# EAGLE design Final (EAGLE 9.4.2)

## Sheet 1 of 2
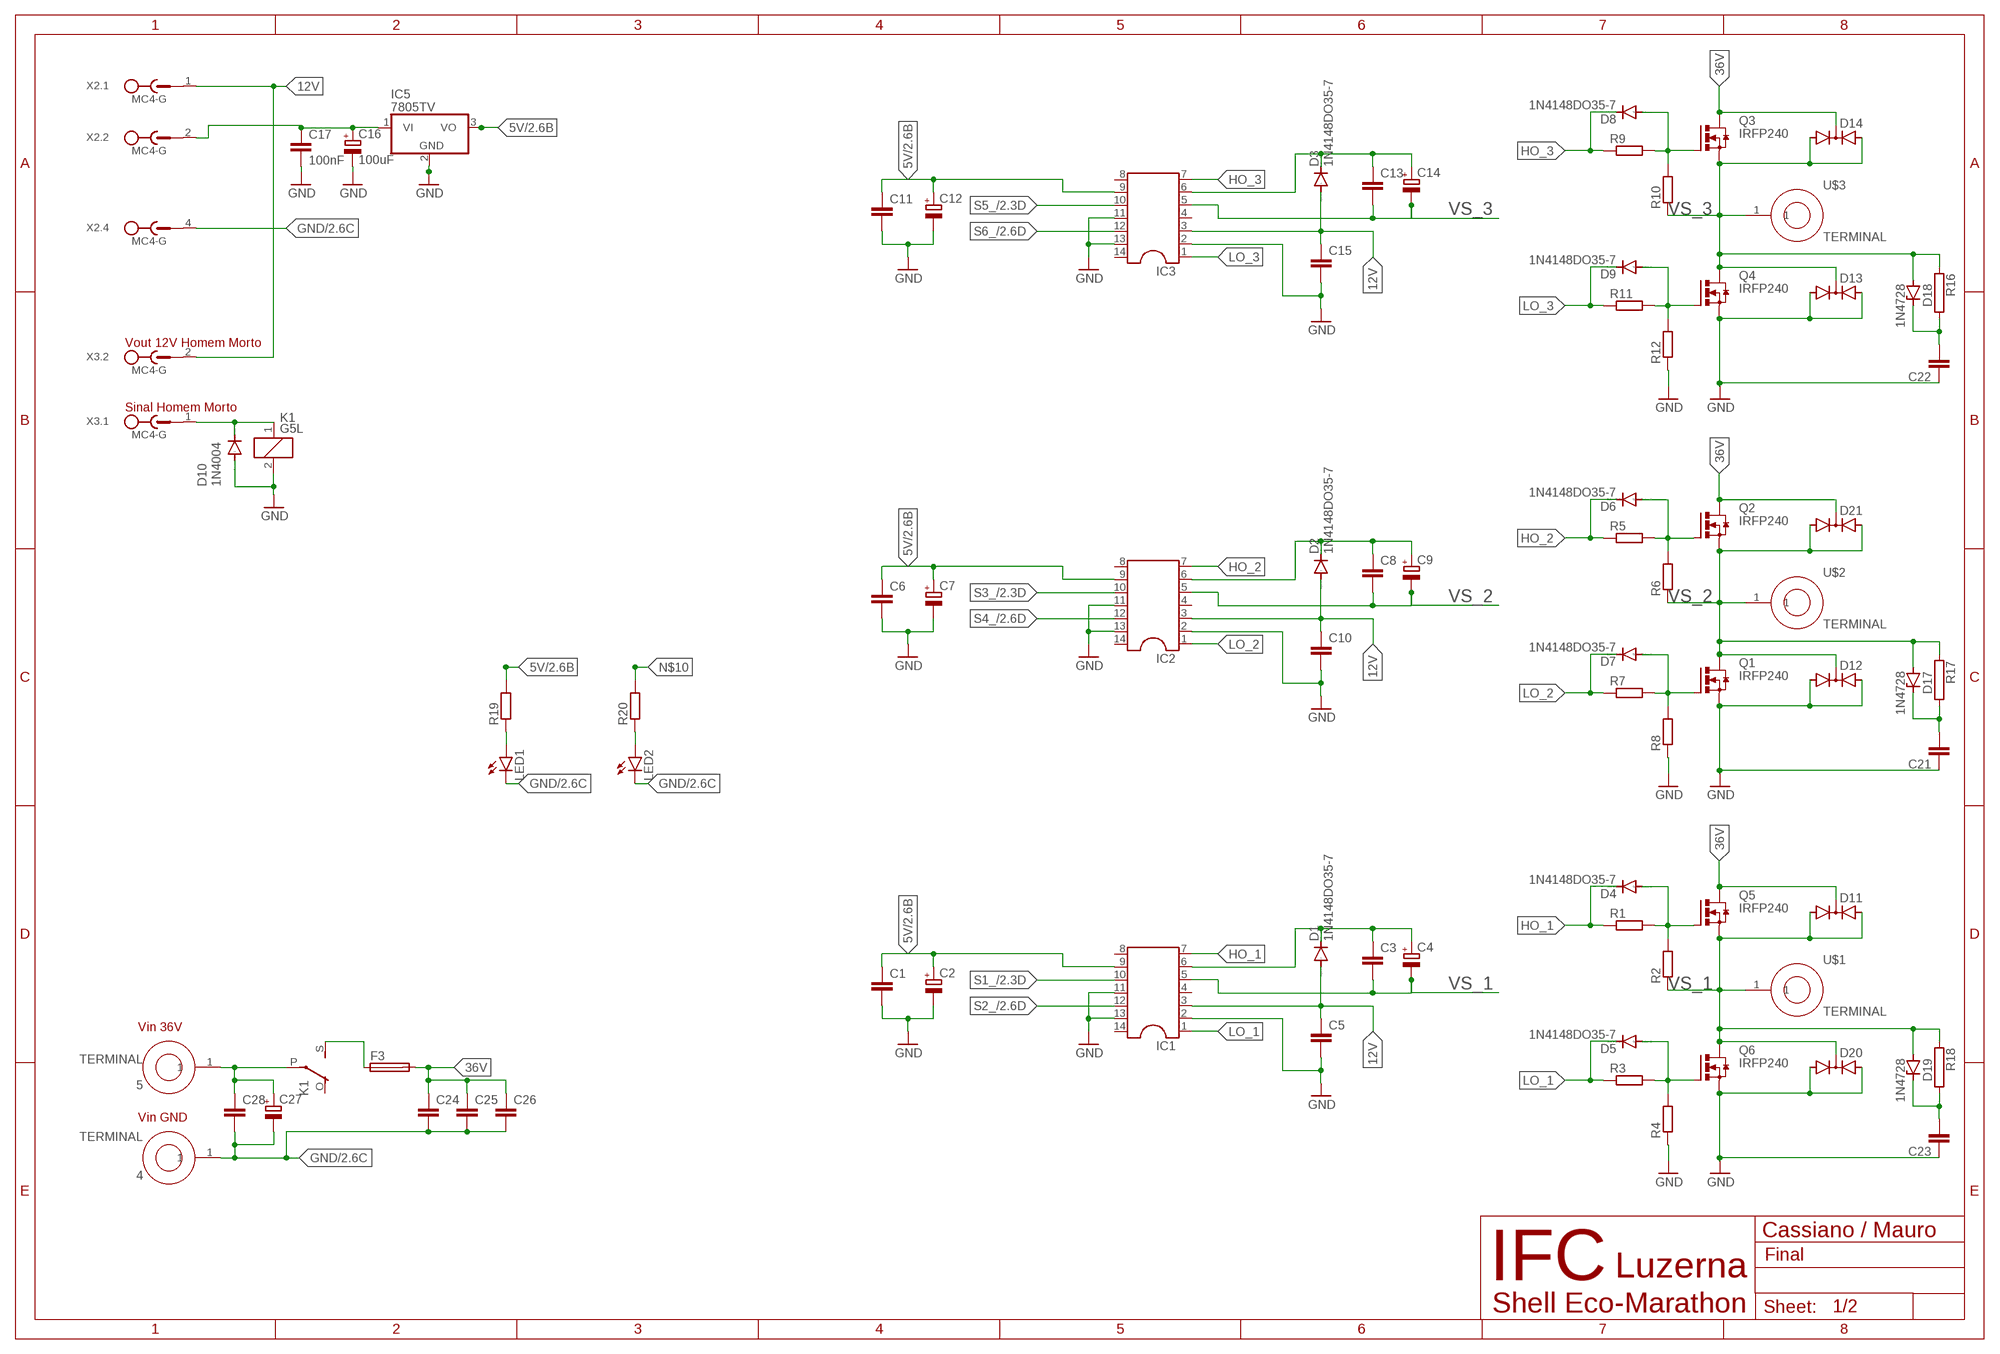
[diagram p0: schematic, sheet 1]

### Parts
4  TERMINAL  [TERMINAL]
5  TERMINAL  [TERMINAL]
C1  C-EU050-045X075  [C050-045X075]
C2  CPOL-EUE2.5-7  [E2,5-7]
C3  C-EU050-025X075  [C050-025X075]
C4  CPOL-EUE2.5-7  [E2,5-7]
C5  C-EU050-025X075  [C050-025X075]
C6  C-EU050-045X075  [C050-045X075]
C7  CPOL-EUE2.5-7  [E2,5-7]
C8  C-EU050-025X075  [C050-025X075]
C9  CPOL-EUE2.5-7  [E2,5-7]
C10  C-EU050-025X075  [C050-025X075]
C11  C-EU050-045X075  [C050-045X075]
C12  CPOL-EUE2.5-7  [E2,5-7]
C13  C-EU050-025X075  [C050-025X075]
C14  CPOL-EUE2.5-7  [E2,5-7]
C15  C-EU050-025X075  [C050-025X075]
C16  100uF  CPOL-EUE2.5-7  [E2,5-7]
C17  100nF  C-EU050-045X075  [C050-045X075]
C21  C-EU150-054X183  [C150-054X183]
C22  C-EU150-054X183  [C150-054X183]
C23  C-EU150-054X183  [C150-054X183]
C24  C-EU275-093X316  [C275-093X316]
C25  C-EU275-093X316  [C275-093X316]
C26  C-EU275-093X316  [C275-093X316]
C27  CPOL-EUE10-22.5  [EB22,5D]
C28  C-EU275-093X316  [C275-093X316]
D1  1N4148DO35-7  [DO35-7]
D2  1N4148DO35-7  [DO35-7]
D3  1N4148DO35-7  [DO35-7]
D4  1N4148DO35-7  [DO35-7]
D5  1N4148DO35-7  [DO35-7]
D6  1N4148DO35-7  [DO35-7]
D7  1N4148DO35-7  [DO35-7]
D8  1N4148DO35-7  [DO35-7]
D9  1N4148DO35-7  [DO35-7]
D10  1N4004  [DO41-10]
D11  DIODE-2AC|CATO220V  [TO220ABS]
D12  DIODE-2AC|CATO220V  [TO220ABS]
D13  DIODE-2AC|CATO220V  [TO220ABS]
D14  DIODE-2AC|CATO220V  [TO220ABS]
D17  1N4728  [DO41Z10]
D18  1N4728  [DO41Z10]
D19  1N4728  [DO41Z10]
D20  DIODE-2AC|CATO220V  [TO220ABS]
D21  DIODE-2AC|CATO220V  [TO220ABS]
F3  SH22,5A  [SH22,5A]
IC1  DIL14  [DIL14]
IC2  DIL14  [DIL14]
IC3  DIL14  [DIL14]
IC5  7805TV  [TO220V]
K1  G5L  [G5LE]
LED1  LED5MM  [LED5MM]
LED2  LED5MM  [LED5MM]
Q1  IRFP240  [TO247BV]
Q2  IRFP240  [TO247BV]
Q3  IRFP240  [TO247BV]
Q4  IRFP240  [TO247BV]
Q5  IRFP240  [TO247BV]
Q6  IRFP240  [TO247BV]
R1  R-EU_0204/7  [0204/7]
R2  R-EU_0204/7  [0204/7]
R3  R-EU_0204/7  [0204/7]
R4  R-EU_0204/7  [0204/7]
R5  R-EU_0204/7  [0204/7]
R6  R-EU_0204/7  [0204/7]
R7  R-EU_0204/7  [0204/7]
R8  R-EU_0204/7  [0204/7]
R9  R-EU_0204/7  [0204/7]
R10  R-EU_0204/7  [0204/7]
R11  R-EU_0204/7  [0204/7]
R12  R-EU_0204/7  [0204/7]
R16  RCA4150  [CA4150]
R17  RCA4150  [CA4150]
R18  RCA4150  [CA4150]
R19  R-EU_0204/7  [0204/7]
R20  R-EU_0204/7  [0204/7]
U$1  TERMINAL  [TERMINAL]
U$2  TERMINAL  [TERMINAL]
U$3  TERMINAL  [TERMINAL]
X2  MC4-G  [MC4-G]
X3  MC4-G  [MC4-G]

### Nets
5V: C1.1 C2.+ C6.1 C7.+ C11.1 C12.+ IC1.9 IC2.9 IC3.9 IC5.3(VO) R19.2 ; also sheet 2
12V: C5.1 C10.1 C15.1 D1.A D2.A D3.A IC1.3 IC2.3 IC3.3 X2.1 X3.2
36V: C24.1 C25.1 C26.1 D11.C D14.C D21.C F3.2 Q2.D Q3.D Q5.D
GND: 4.1 C1.2 C2.- C5.2 C6.2 C7.- C10.2 C11.2 C12.- C15.2 C16.- C17.2 C21.1 C22.1 C23.1 C24.2 C25.2 C26.2 C27.- C28.2 D10.A D12.A1 D12.A2 D13.A1 D13.A2 D20.A1 D20.A2 IC1.2 IC1.11 IC1.13 IC2.2 IC2.11 IC2.13 IC3.2 IC3.11 IC3.13 IC5.2(GND) K1.2 LED1.K(C) LED2.K(C) Q1.S Q4.S Q6.S R4.1 R8.1 R12.1 X2.4 ; also sheet 2
HO_1: D4.C IC1.7 R1.1
HO_2: D6.C IC2.7 R5.1
HO_3: D8.C IC3.7 R9.1
LO_1: D5.C IC1.1 R3.1
LO_2: D7.C IC2.1 R7.1
LO_3: D9.C IC3.1 R11.1
N$1: D4.A Q5.G R1.2 R2.2
N$2: D5.A Q6.G R3.2 R4.2
N$3: F3.1 K1.S(2:S)
N$4: D6.A Q2.G R5.2 R6.2
N$5: D7.A Q1.G R7.2 R8.2
N$7: D8.A Q3.G R9.2 R10.2
N$8: D9.A Q4.G R11.2 R12.2
N$9: C16.+ C17.1 IC5.1(VI) X2.2
N$10: D10.C K1.1 R20.2 X3.1
N$11: 5.1 C27.+ C28.1 K1.P(2:P)
N$14: LED1.A R19.1
N$19: LED2.A R20.1
N$29: C22.2 D18.C R16.2
N$30: C21.2 D17.C R17.2
N$31: C23.2 D19.C R18.2
S1_: IC1.10 ; also sheet 2
S2_: IC1.12 ; also sheet 2
S3_: IC2.10 ; also sheet 2
S4_: IC2.12 ; also sheet 2
S5_: IC3.10 ; also sheet 2
S6_: IC3.12 ; also sheet 2
VB_1: C3.1 C4.+ D1.C IC1.6
VB_2: C8.1 C9.+ D2.C IC2.6
VB_3: C13.1 C14.+ D3.C IC3.6
VS_1: C3.2 C4.- D11.A1 D11.A2 D19.A D20.C IC1.5 Q5.S Q6.D R2.1 R18.1 U$1.1
VS_2: C8.2 C9.- D12.C D17.A D21.A1 D21.A2 IC2.5 Q1.D Q2.S R6.1 R17.1 U$2.1
VS_3: C13.2 C14.- D13.C D14.A1 D14.A2 D18.A IC3.5 Q3.S Q4.D R10.1 R16.1 U$3.1
Unconnected: IC1.4 IC1.8 IC1.14 IC2.4 IC2.8 IC2.14 IC3.4 IC3.8 IC3.14 K1.O(2:O) X2.3 X3.3 X3.4

### Notes on the sheet
- Vout 12V Homem Morto
- Sinal Homem Morto
- Vin 36V
- Vin GND
- Cassiano / Mauro
- IFC | Luzerna
- Shell Eco-Marathon

## Sheet 2 of 2
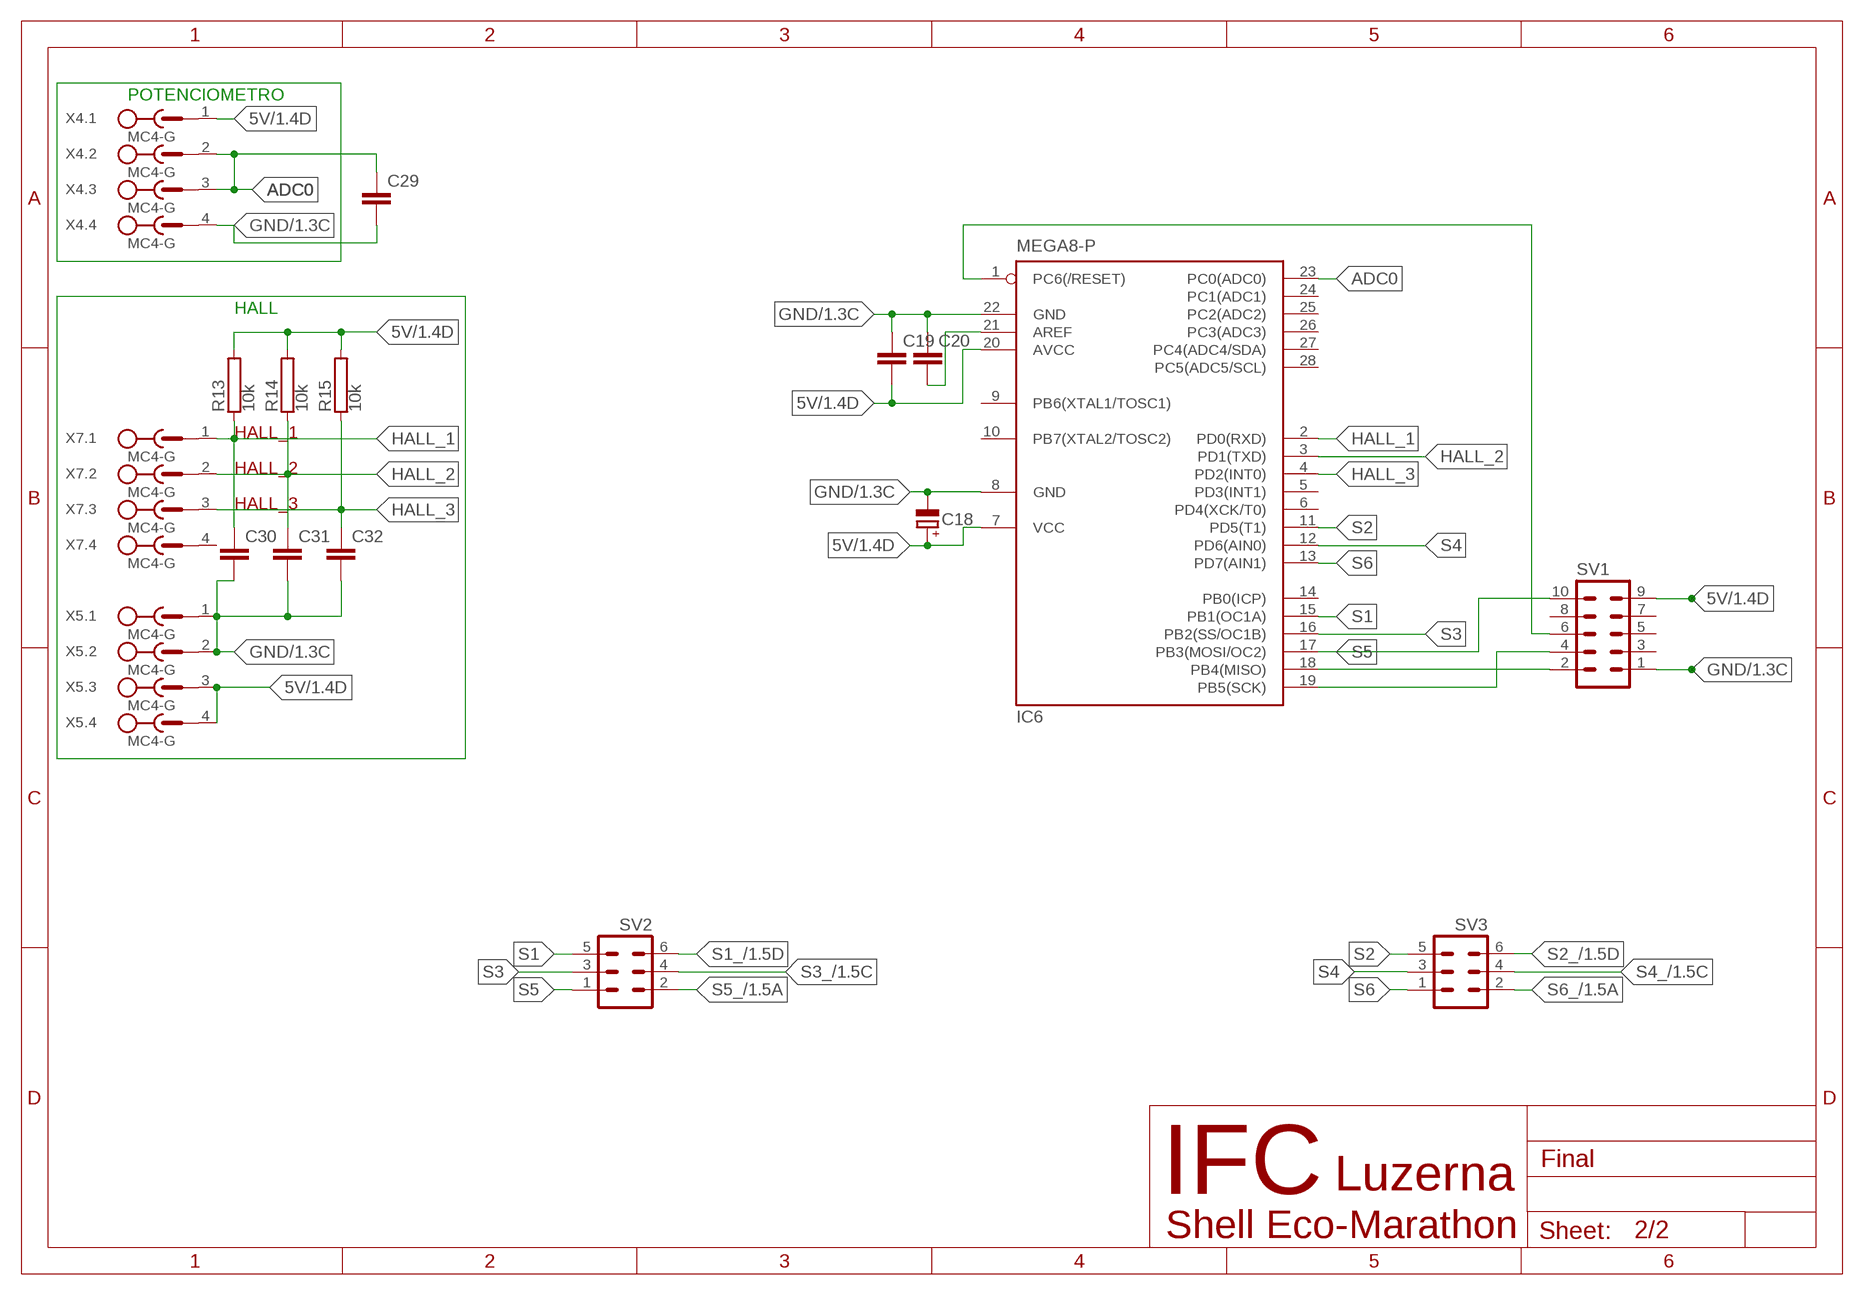
[diagram p1: schematic, sheet 2]

### Parts
C18  CPOL-EUE3.5-10  [E3,5-10]
C19  C-EU075-032X103  [C075-032X103]
C20  C-EU075-032X103  [C075-032X103]
C29  C-EU075-032X103  [C075-032X103]
C30  C-EU075-032X103  [C075-032X103]
C31  C-EU075-032X103  [C075-032X103]
C32  C-EU075-032X103  [C075-032X103]
IC6  MEGA8-P  [DIL28-3]
R13  10k  RRS1/4  [RS1/4]
R14  10k  RRS1/4  [RS1/4]
R15  10k  RRS1/4  [RS1/4]
SV1  MA05-2  [MA05-2]
SV2  MA03-2  [MA03-2]
SV3  MA03-2  [MA03-2]
X4  MC4-G  [MC4-G]
X5  MC4-G  [MC4-G]
X7  MC4-G  [MC4-G]

### Nets
5V: C18.+ C19.2 IC6.7(VCC) IC6.20(AVCC) R13.2 R14.2 R15.2 SV1.9 X4.1 X5.3 X5.4 ; also sheet 1
ADC0: C29.1 IC6.23(PC0(ADC0)) X4.2 X4.3
GND: C18.- C19.1 C20.1 C29.2 C30.2 C31.2 C32.2 IC6.8(GND) IC6.22(GND) SV1.1 X4.4 X5.1 X5.2 ; also sheet 1
HALL_1: C30.1 IC6.2(PD0(RXD)) R13.1 X7.1
HALL_2: C31.1 IC6.3(PD1(TXD)) R14.1 X7.2
HALL_3: C32.1 IC6.4(PD2(INT0)) R15.1 X7.3
N$18: C20.2 IC6.21(AREF)
N$20: IC6.19(PB5(SCK)) SV1.4
N$21: IC6.18(PB4(MISO)) SV1.2
N$22: IC6.1(PC6(/RESET)) SV1.6
S1: IC6.15(PB1(OC1A)) SV2.5
S1_: SV2.6 ; also sheet 1
S2: IC6.11(PD5(T1)) SV3.5
S2_: SV3.6 ; also sheet 1
S3: IC6.16(PB2(SS/OC1B)) SV2.3
S3_: SV2.4 ; also sheet 1
S4: IC6.12(PD6(AIN0)) SV3.3
S4_: SV3.4 ; also sheet 1
S5: IC6.17(PB3(MOSI/OC2)) SV1.10 SV2.1
S5_: SV2.2 ; also sheet 1
S6: IC6.13(PD7(AIN1)) SV3.1
S6_: SV3.2 ; also sheet 1
Unconnected: IC6.5(PD3(INT1)) IC6.6(PD4(XCK/T0)) IC6.9(PB6(XTAL1/TOSC1)) IC6.10(PB7(XTAL2/TOSC2)) IC6.14(PB0(ICP)) IC6.24(PC1(ADC1)) IC6.25(PC2(ADC2)) IC6.26(PC3(ADC3)) IC6.27(PC4(ADC4/SDA)) IC6.28(PC5(ADC5/SCL)) SV1.3 SV1.5 SV1.7 SV1.8 X7.4

### Notes on the sheet
- POTENCIOMETRO
- HALL
- IFC | Luzerna
- Shell Eco-Marathon

## Library data of the parts
4 5 U$1-U$3 = ,Kerschbaumer:TERMINAL
C1 C3 C5 C6 C8 C10 C11 C13 C15 C17 C19-C26 C28-C32 = rcl:C-EU: CAPACITOR, European symbol; SPICEPREFIX: C
C2 C4 C7 C9 C12 C14 C16 C18 C27 = rcl:CPOL-EU: POLARIZED CAPACITOR, European symbol; SPICEPREFIX: C
D1-D9 = diode:1N4148: DIODE high speed (Philips)
D10 = diode:1N4004: DIODE general purpose rectifier, 1 A
D11-D14 D20 D21 = diode:DIODE-2AC|CA: Dual DIODE Anode-Cathode|Cathode-Anode
D17-D19 = diode:1N4728: Z DIODE 3.3 V, 1W, 5 percent
F3 = fuse:SH22,5A: FUSE HOLDER grid 22,5mm, isolated cap OGN0031 8201, Schurter (Buerklin); MPN: 0031.7701.11; OC_FARNELL: unknown; OC_NEWARK: 04F1224
IC1-IC3 = ic-package:DIL14: Dual In Line / Socket
IC5 = linear:78*: Positive VOLTAGE REGULATOR Source: http://cache.national.com/ds/LM/LM78L05.pdf http://www.fairchildsemi.com/ds/LM/LM7805.pdf
IC6 = atmel:MEGA8-P: MICROCONTROLLER 8 Kbytes FLASH, 1 kbytes SRAM, 512 bytes EEPROM, USART, 4-channel 10 bit ADC, 2-channel 8 bit ADC Pin compatible with Atmega48, ATMega88, ATMega168 Source: avr.lbr; OC_FARNELL: unknown; OC_NEWARK: unknown
K1 = relay:G5L: RELAY 1 x switch, 10 A/120 V AC, 8 A/30 V ADC, Omron; OC_FARNELL: unknown; OC_NEWARK: unknown
LED1 LED2 = led:LED: LED OSRAM: - CHIPLED LG R971, LG N971, LY N971, LG Q971, LY Q971, LO R971, LY R971 LH N974, LH R974 LS Q976, LO Q976, LY Q976 LO Q996 - Hyper CHIPLED LW Q18S LB Q993, LB Q99A, LB R99A - SideLED LS A670, LO A670, LY A670, LG A670, LP A670 LB A673, LV A673, LT A673, LW A673 LH A674 LY A675 LS A676, LA A676, LO A676, LY A676, LW A676 LS A679, LY A679, LG A679 - Hyper Micro SIDELED® LS Y876, LA Y876, LO Y876, LY Y876 LT Y87S - SmartLED LW L88C, LW L88S LB L89C, LB L89S, LG L890 LS L89K, LO L89K, LY L89K LS L896, LA L896, LO L896, LY L896 - TOPLED LS T670, LO T670, LY T670, LG T670, LP T670 LSG T670, LSP T670, LSY T670, LOP T670, LYG T670 LG T671, LOG T671, LSG T671 LB T673, LV T673, LT T673, LW T673 LH T674 LS T676, LA T676, LO T676, LY T676, LB T676, LH T676, LSB T676, LW T676 LB T67C, LV T67C, LT T67C, LS T67K, LO T67K, LY T67K, LW E67C LS E67B, LA E67B, LO E67B, LY E67B, LB E67C, LV E67C, LT E67C LW T67C LS T679, LY T679, LG T679 LS T770, LO T770, LY T770, LG T770, LP T770 LB T773, LV T773, LT T773, LW T773 LH T774 LS E675, LA E675, LY E675, LS T675 LS T776, LA T776, LO T776, LY T776, LB T776 LHGB T686 LT T68C, LB T68C - Hyper Mini TOPLED® LB M676 - Mini TOPLED Santana® LG M470 LS M47K, LO M47K, LY M47K Source: http://www.osram.convergy.de LUXEON: - LUMILED® LXK2-PW12-R00, LXK2-PW12-S00, LXK2-PW14-U00, LXK2-PW14-V00 LXK2-PM12-R00, LXK2-PM12-S00, LXK2-PM14-U00 LXK2-PE12-Q00, LXK2-PE12-R00, LXK2-PE12-S00, LXK2-PE14-T00, LXK2-PE14-U00 LXK2-PB12-K00, LXK2-PB12-L00, LXK2-PB12-M00, LXK2-PB14-N00, LXK2-PB14-P00, LXK2-PB14-Q00 LXK2-PR12-L00, LXK2-PR12-M00, LXK2-PR14-Q00, LXK2-PR14-R00 LXK2-PD12-Q00, LXK2-PD12-R00, LXK2-PD12-S00 LXK2-PH12-R00, LXK2-PH12-S00 LXK2-PL12-P00, LXK2-PL12-Q00, LXK2-PL12-R00 Source: www.luxeon.com KINGBRIGHT: KA-3528ASYC Source: www.kingbright.com
Q1-Q6 = transistor-power:IRFP240: HEXFET Power MosFet Source: http://www.irf.com/
R1-R12 R19 R20 = rcl:R-EU_: RESISTOR, European symbol
R13-R15 = resistor-power:R: Power Resitor; MF: OHMITE; MPN: RRS1K0; OC_FARNELL: unknown; OC_NEWARK: 01F7661
R16-R18 = resistor-power:R: Power Resitor; OC_FARNELL: unknown; OC_NEWARK: unknown
SV1 = con-lstb:MA05-2: PIN HEADER; OC_FARNELL: unknown; OC_NEWARK: unknown
SV2 SV3 = con-lstb:MA03-2: PIN HEADER; OC_FARNELL: unknown; OC_NEWARK: unknown
X2-X5 X7 = con-phoenix-381_l:MC4-G: Mini-Combicon 3.81mm horizontal 4-polig MC 1,5/4-G-3,81 Artikel-Nr. 1803293 mit Gegenstecker MC 1,5/4-ST-3,81 Artikel-Nr. 1803594

## Board
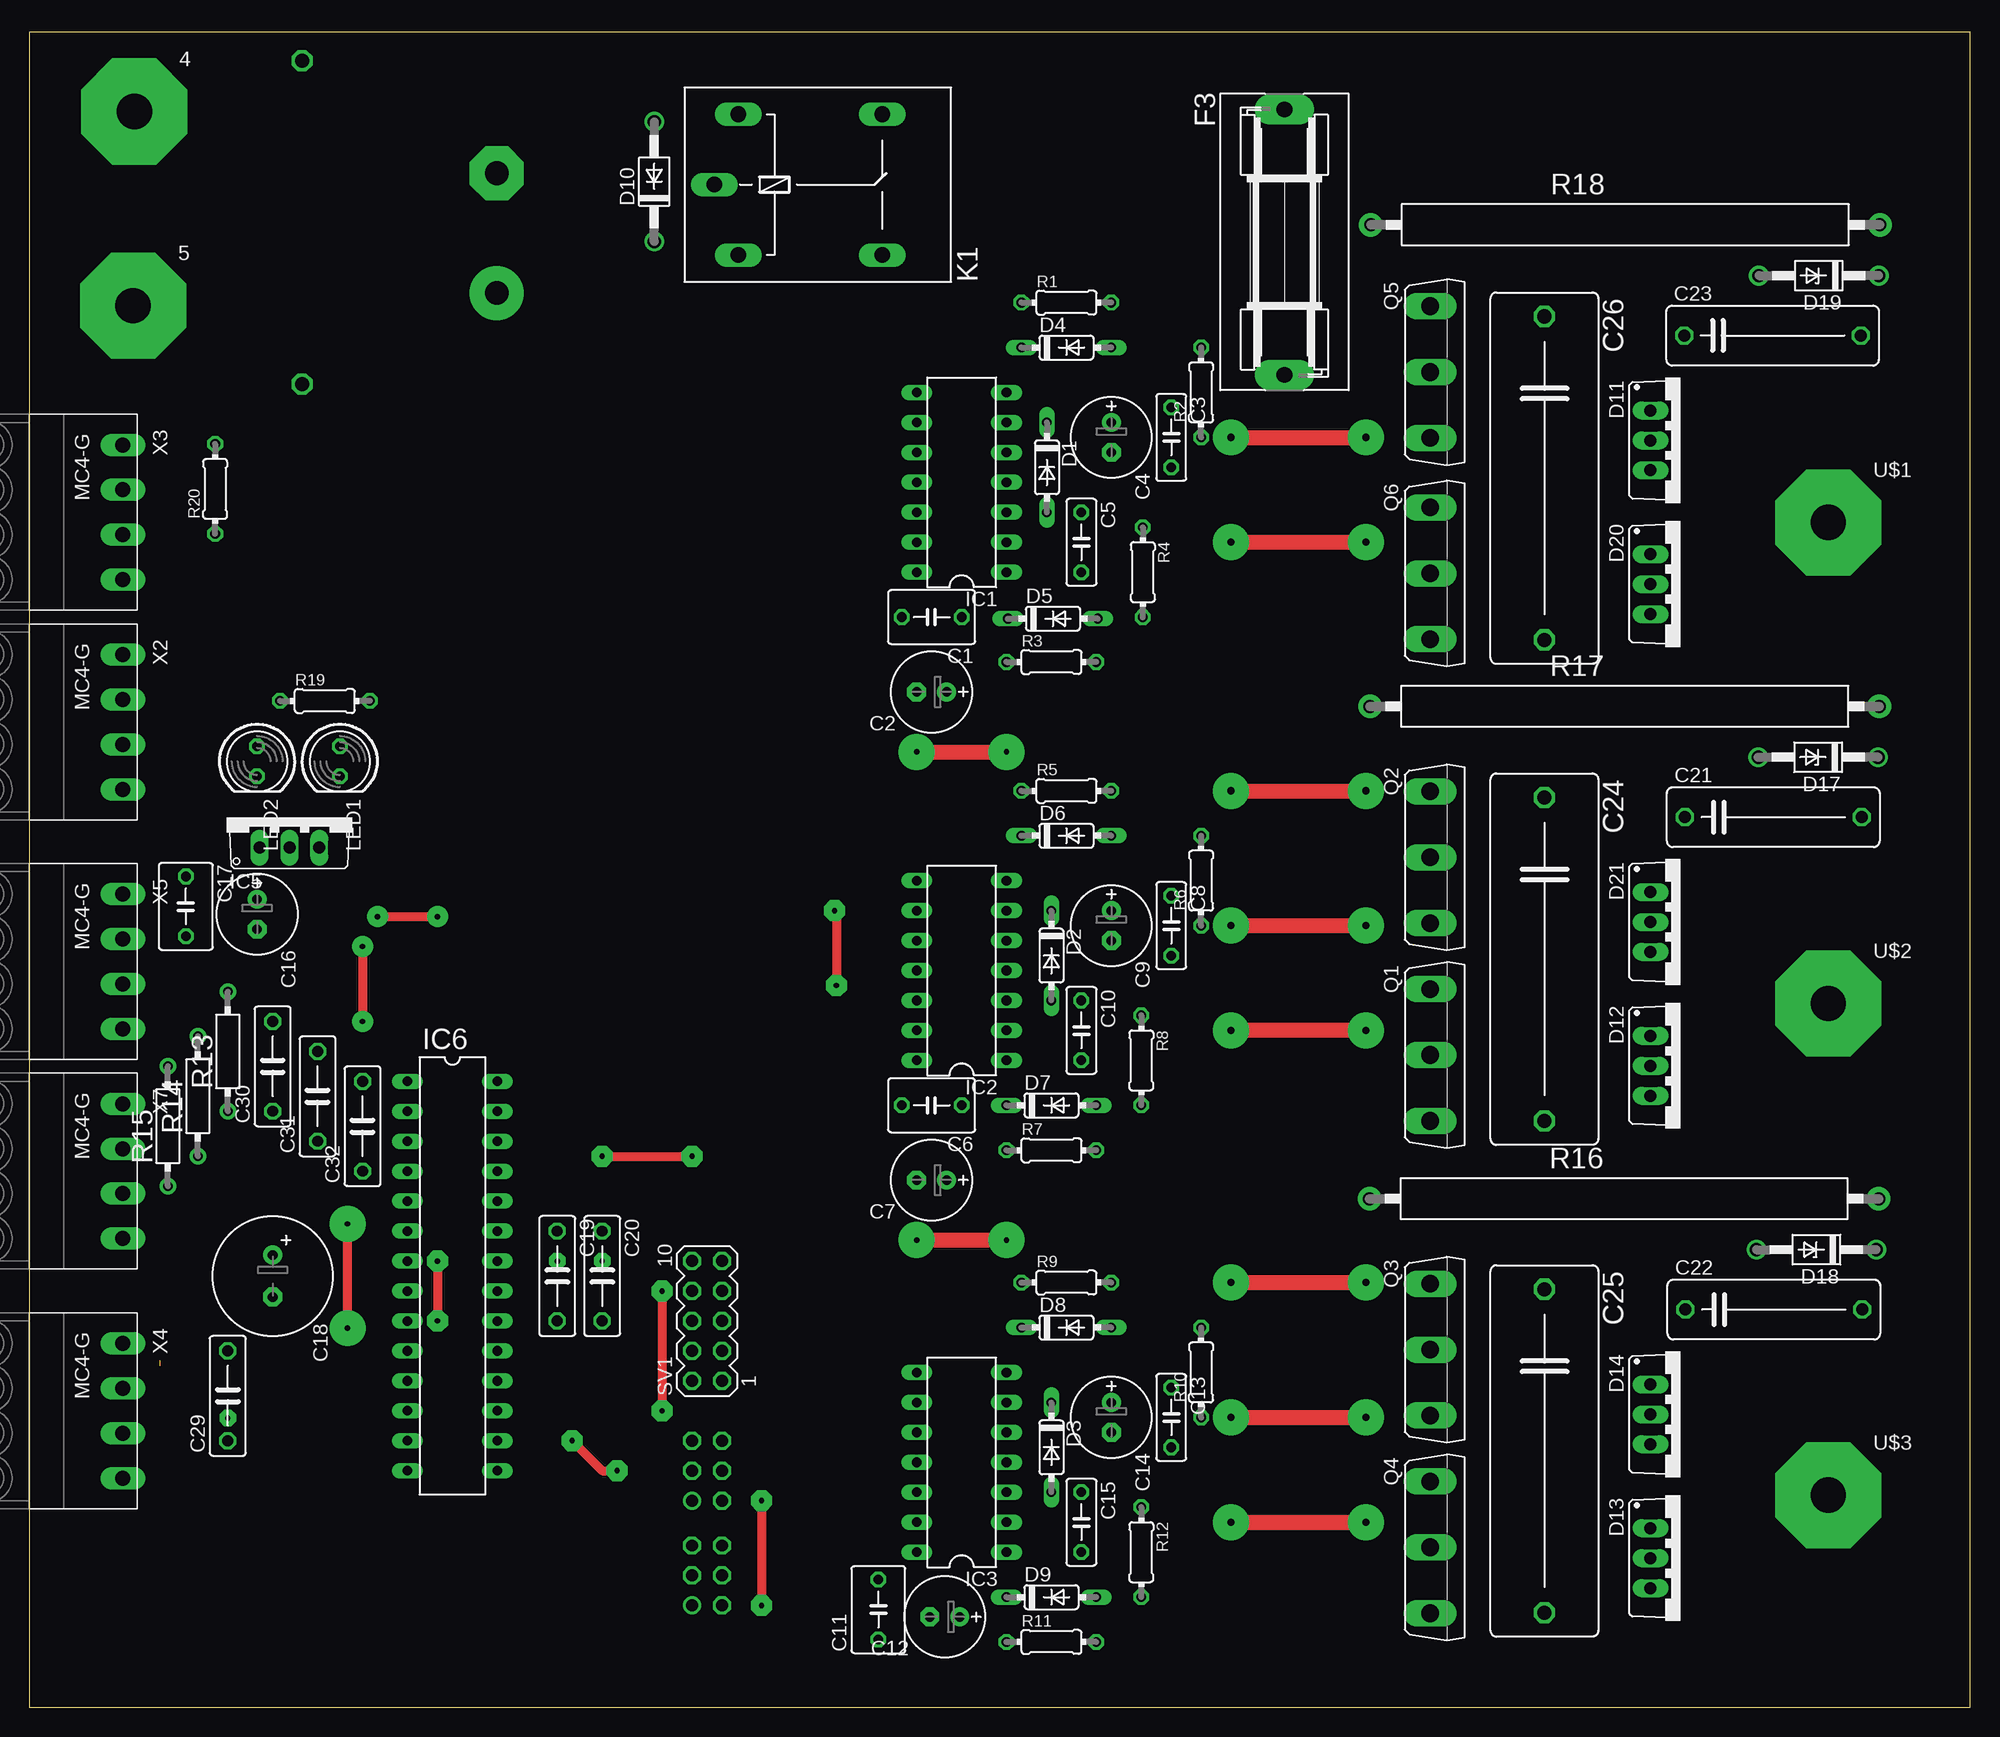
[diagram p2: board, top side]
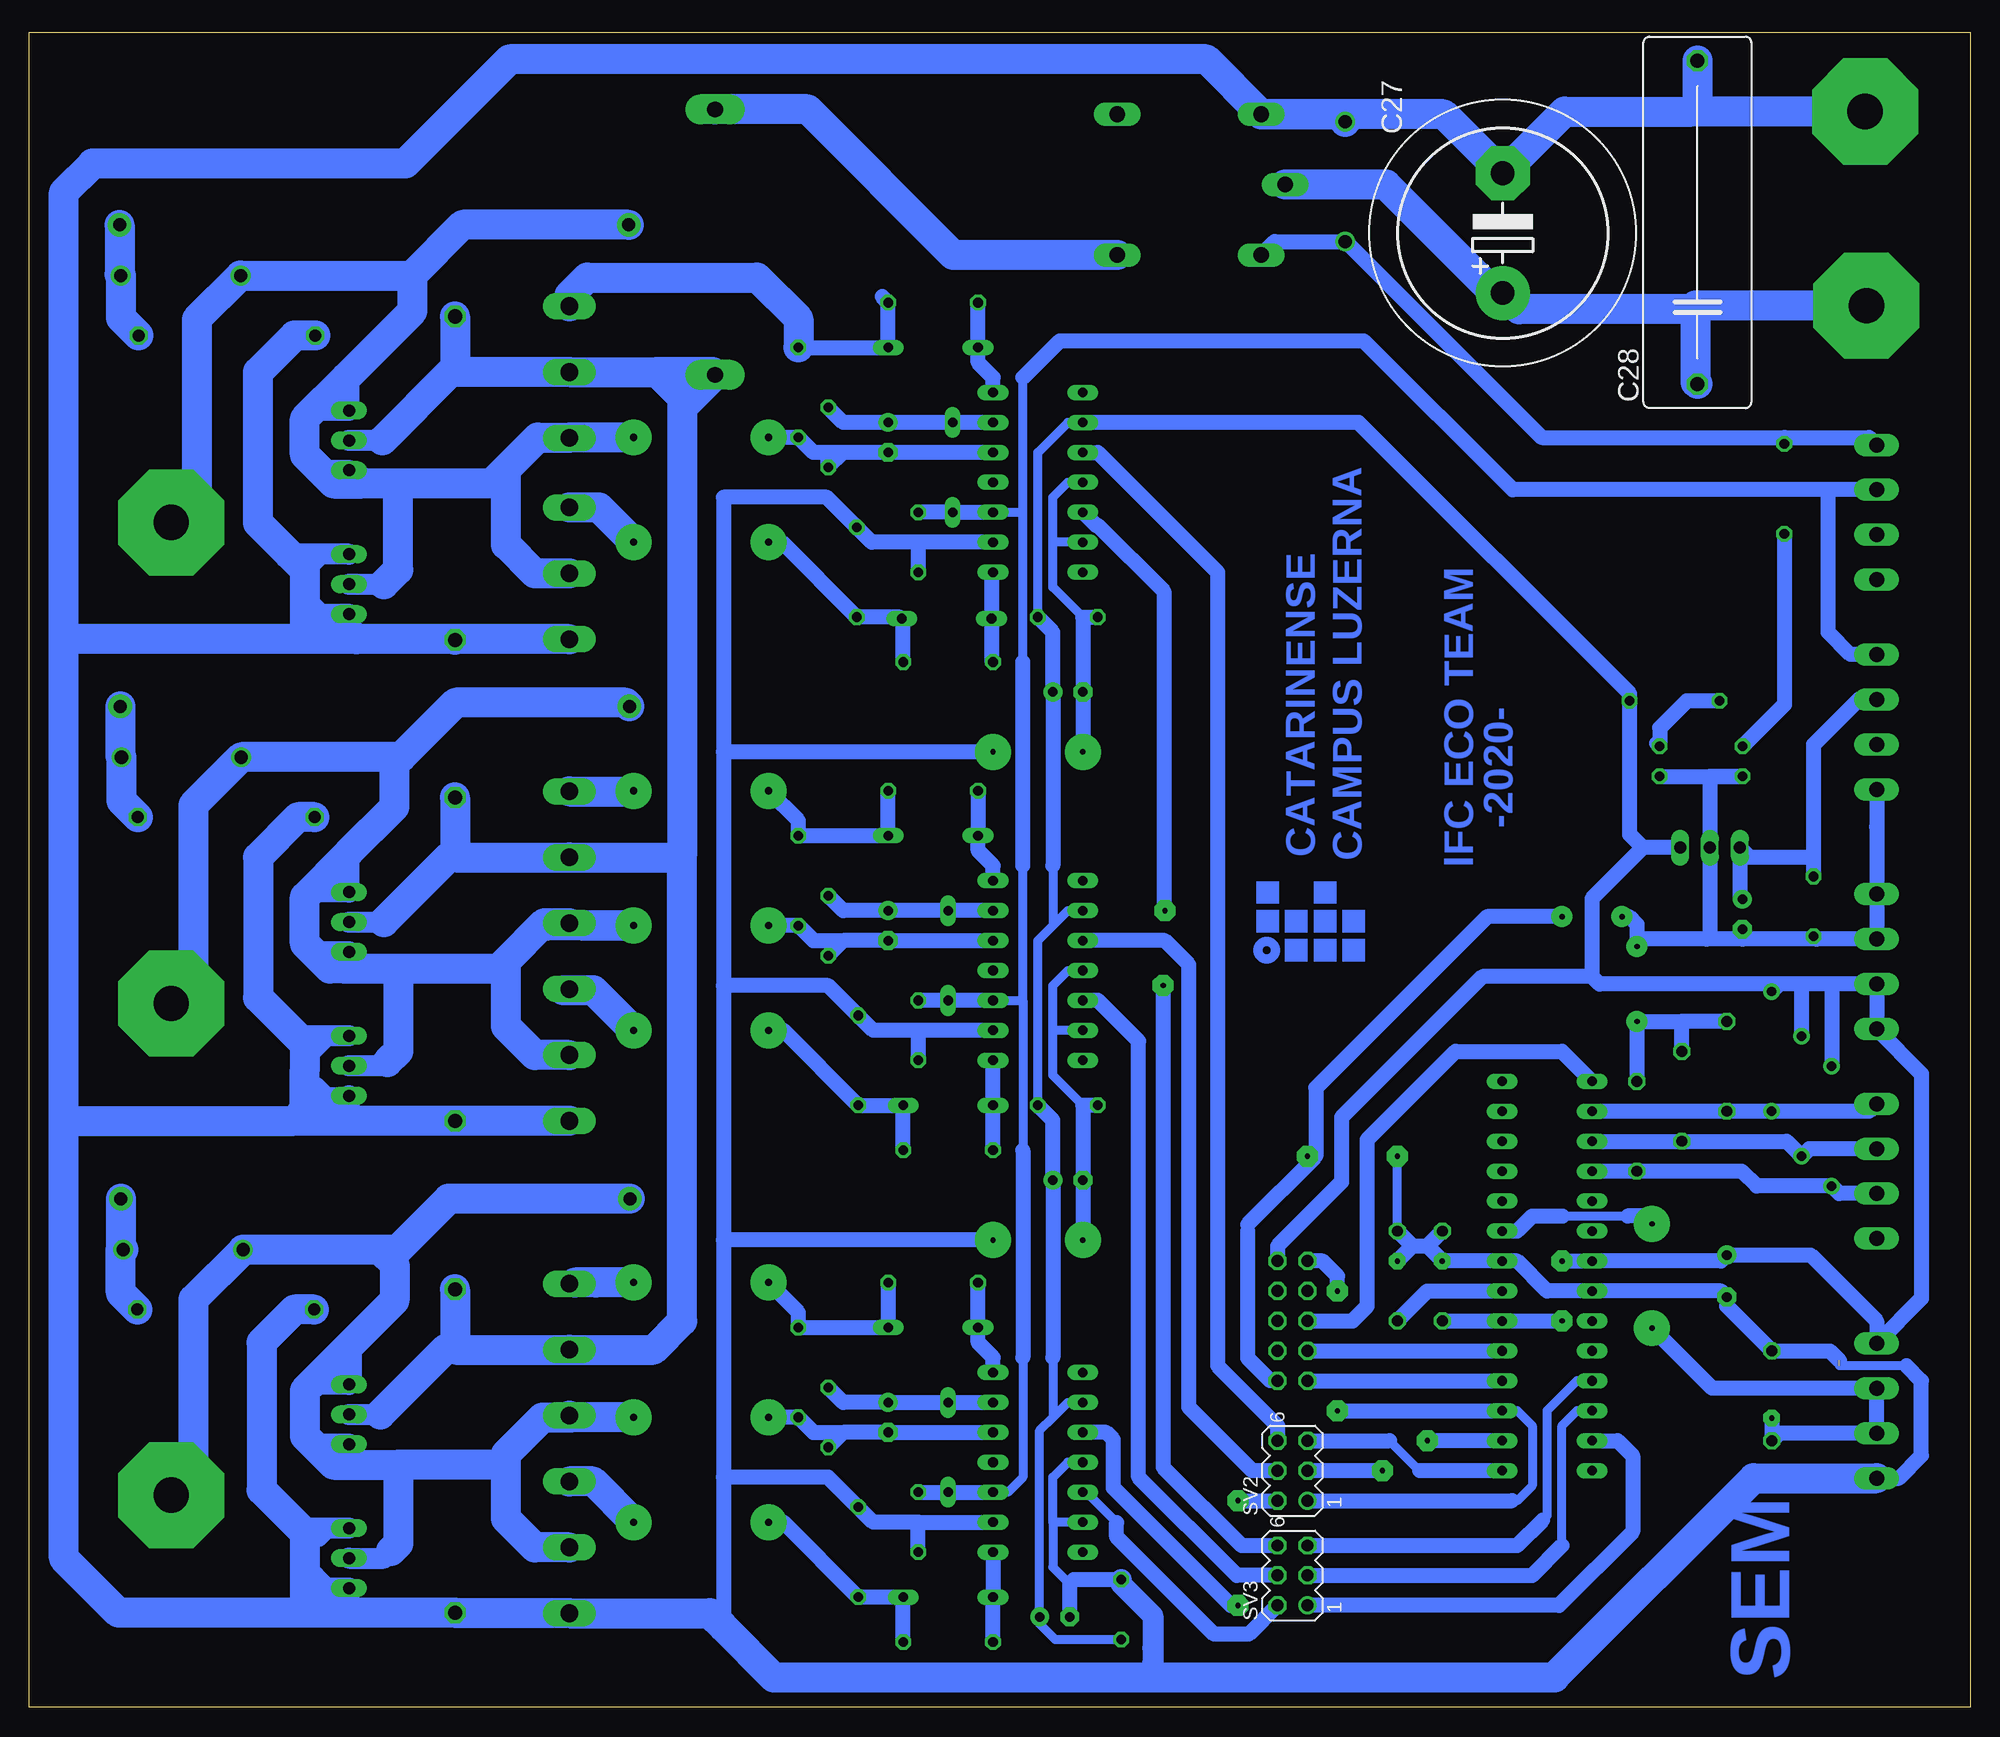
[diagram p3: board, bottom side, seen from below]

Size 164.57 x 142.08 mm. Coordinates in mm from the lower left corner, seen from the top.
Outline: 0,0 164.57,0 164.57,142.08 0,142.08 0,0
Copper layers (1*16): Top 0.035mm / dielectric 1.5mm / Bottom 0.035mm
Design rules "default": minimum track width 6mil, minimum drill 0.35mm, track to track 6mil, track to pad 6mil, pad to pad 6mil, via to via 6mil, smd to smd 6mil, copper to edge 40mil, drill to drill 6mil, minimum pad ring 10mil, minimum via ring 8mil, stop-mask expansion 4mil, vias tented up to drill 0mil, thermal gap 10mil
Holes 6.35 mm at 3.66,148.49 3.66,-12.8 185.27,-12.8 162.41,149.76

### Footprints (pad centres in the part's own frame; a part is rotated, then mirrored left to right if it is on the bottom)
TERMINAL = drill 3 pad 9 octagon: 1 0,0
C050-045X075 = drill 0.813 octagon: 1 -2.54,0; 2 2.54,0
E2,5-7 = drill 0.813 pad 1.6: + -1.27,0 | drill 0.813 pad 1.6 octagon: - 1.27,0
C050-025X075 = drill 0.813 octagon: 1 -2.54,0; 2 2.54,0
E3,5-10 = drill 0.813 pad 1.6: + -1.778,0 | drill 0.813 pad 1.6 octagon: - 1.778,0
C075-032X103 = drill 0.914 octagon: 1 -3.81,0; 2 3.81,0
C150-054X183 = drill 1.016 octagon: 1 -7.493,0; 2 7.493,0
C275-093X316 = drill 1.194 octagon: 1 -13.716,0; 2 13.716,0
EB22,5D = drill 2.007 pad 4.597: + -5.08,0 | drill 2.007 pad 4.597 octagon: - 5.08,0
DO35-7 = drill 0.813 long: A 3.81,0; C -3.81,0
DO41-10 = drill 1.118: A 5.08,0; C -5.08,0
TO220ABS = drill 1.016 long: A1 -2.54,-2.54; A2 2.54,-2.54; C 0,-2.54
DO41Z10 = drill 1.118: A 5.08,0; C -5.08,0
SH22,5A = drill 1.321 pad 2.54 long: 1 -11.252,0; 2 11.252,0
DIL14 = drill 0.813 long: 1 -7.62,-3.81; 2 -5.08,-3.81; 3 -2.54,-3.81; 4 0,-3.81; 5 2.54,-3.81; 6 5.08,-3.81; 7 7.62,-3.81; 8 7.62,3.81; 9 5.08,3.81; 10 2.54,3.81; 11 0,3.81; 12 -2.54,3.81; 13 -5.08,3.81; 14 -7.62,3.81
TO220V = drill 1.016 long: 1 -2.54,-2.54; 2 0,-2.54; 3 2.54,-2.54
DIL28-3 = drill 0.813 long: 1 -16.51,-3.81; 2 -13.97,-3.81; 3 -11.43,-3.81; 4 -8.89,-3.81; 5 -6.35,-3.81; 6 -3.81,-3.81; 7 -1.27,-3.81; 8 1.27,-3.81; 9 3.81,-3.81; 10 6.35,-3.81; 11 8.89,-3.81; 12 11.43,-3.81; 13 13.97,-3.81; 14 16.51,-3.81; 15 16.51,3.81; 16 13.97,3.81; 17 11.43,3.81; 18 8.89,3.81; 19 6.35,3.81; 20 3.81,3.81; 21 1.27,3.81; 22 -1.27,3.81; 23 -3.81,3.81; 24 -6.35,3.81; 25 -8.89,3.81; 26 -11.43,3.81; 27 -13.97,3.81; 28 -16.51,3.81
G5LE = drill 1.321 long: 1 -7.493,-5.969; 2 -7.493,5.969; O 4.699,5.969; P -9.525,0; S 4.699,-5.969
LED5MM = drill 0.813 octagon: A -1.27,0; K 1.27,0
TO247BV = drill 1.499 long: D 0,-2.921; G -5.588,-2.921; S 5.588,-2.921
0204/7 = drill 0.813 octagon: 1 -3.81,0; 2 3.81,0
RS1/4 = drill 0.8 pad 1.4: 1 -5.08,0; 2 5.08,0
CA4150 = drill 1.1 pad 2: 1 -21.59,0; 2 21.59,0
MA05-2 = drill 1.016 octagon: 1 -5.08,-1.27; 2 -5.08,1.27; 3 -2.54,-1.27; 4 -2.54,1.27; 5 0,-1.27; 6 0,1.27; 7 2.54,-1.27; 8 2.54,1.27; 9 5.08,-1.27; 10 5.08,1.27
MA03-2 = drill 1.016: 1 -2.54,-1.27 | drill 1.016 octagon: 2 -2.54,1.27; 3 0,-1.27; 4 0,1.27; 5 2.54,-1.27; 6 2.54,1.27
MC4-G = drill 1.27 long: 1 -5.715,0; 2 -1.905,0; 3 1.905,0; 4 5.715,0

### Placement (x,y rotation side)
4  8.89,135.33 0 top
5  8.79,118.87 0 top
C1  76.5,92.46 180 top
C2  76.5,86.11 180 top
C3  96.82,107.7 270 top
C4  91.74,107.7 270 top
C5  89.2,98.81 270 top
C6  76.5,51.05 180 top
C7  76.5,44.7 180 top
C8  96.82,66.29 270 top
C9  91.74,66.29 270 top
C10  89.2,57.4 270 top
C11  71.98,8.28 90 top
C12  77.62,7.67 180 top
C13  96.82,24.59 270 top
C14  91.74,24.59 270 top
C15  89.2,15.7 270 top
C16  19.3,67.26 270 top
C17  13.26,67.92 270 top
C18  20.62,36.58 270 top
C19  44.75,36.58 270 top
C20  48.56,36.58 270 top
C21  147.88,75.49 0 top
C22  147.93,33.73 0 top
C23  147.83,116.33 0 top
C24  128.47,63.45 270 top
C25  128.47,21.74 270 top
C26  128.47,104.24 270 top
C27  39.62,125.02 90 bottom
C28  23.11,125.93 90 bottom
C29  16.81,26.42 90 top
C30  20.62,54.36 90 top
C31  24.43,51.82 90 top
C32  28.24,49.28 90 top
D1  86.28,105.16 270 top
D2  86.66,63.75 270 top
D3  86.66,22.05 270 top
D4  87.93,115.32 0 top
D5  86.79,92.33 0 top
D6  87.93,73.91 0 top
D7  86.66,51.05 0 top
D8  87.93,32.21 0 top
D9  86.66,9.35 0 top
D10  52.98,129.39 90 top
D11  140,107.44 270 top
D12  140,54.41 270 top
D13  140,12.65 270 top
D14  140,24.84 270 top
D17  151.69,80.57 180 top
D18  151.54,38.81 180 top
D19  151.74,121.41 180 top
D20  140,95.25 270 top
D21  140,66.6 270 top
F3  106.43,124.26 270 top
IC1  79.04,103.89 90 top
IC2  79.04,62.48 90 top
IC3  79.04,20.78 90 top
IC5  22.05,75.44 0 top
IC6  35.86,36.58 270 top
K1  67.61,129.13 0 top
LED1  26.31,80.21 270 top
LED2  19.3,80.21 270 top
Q1  121.72,55.32 270 top
Q2  121.72,72.09 270 top
Q3  121.72,30.33 270 top
Q4  121.72,13.56 270 top
Q5  121.72,113.23 270 top
Q6  121.72,96.16 270 top
R1  87.93,119.13 0 top
R2  99.36,111.51 90 top
R3  86.66,88.65 0 top
R4  94.41,96.27 270 top
R5  87.93,77.72 0 top
R6  99.36,70.1 90 top
R7  86.66,47.24 0 top
R8  94.28,54.86 270 top
R9  87.93,36.02 0 top
R10  99.36,28.4 90 top
R11  86.66,5.54 0 top
R12  94.28,13.16 270 top
R13  16.81,55.63 90 top
R14  14.27,51.82 90 top
R15  11.73,49.28 90 top
R16  135.23,43.13 0 top
R17  135.28,84.89 0 top
R18  135.33,125.73 0 top
R19  25.04,85.34 0 top
R20  15.75,103.33 90 top
SV1  57.45,32.77 90 top
SV2  57.45,20.07 90 bottom
SV3  57.45,11.18 90 bottom
U$1  152.55,100.48 0 top
U$2  152.55,59.69 0 top
U$3  152.55,17.98 0 top
X2  7.92,83.57 270 top
X3  7.92,101.35 270 top
X4  7.92,25.15 270 top
X5  7.92,63.25 270 top
X7  7.92,45.47 270 top

### Tracks (layer width: path | path; a pad name or v marks a point on that pad's centre or on a via)
5V  (via drill 0.45 pad 1.78)
  Top 0.762: v34.59,37.85 v34.59,32.77
  Bottom 0.762: C1.1 79.04,106.43 76.5,108.97 IC1.9 | C6.1 79.04,65.02 77.77,66.29 | 77.77,66.29 76.5,67.56 IC2.9 | 77.77,71.37 77.77,66.29 | 77.77,24.59 76.5,25.86 IC3.9 | 77.77,29.67 77.77,24.59 | C11.1 77.57,5.74 78.89,7.06 C12.+ 78.89,23.47 77.77,24.59
  Bottom 1.27: C1.1 77.77,91.19 C2.+ 77.77,71.37 | C6.1 77.77,49.78 C7.+ 77.77,29.67 | 14.27,61.34 16.18,61.34 | 16.18,61.34 R13.2 | R14.2 14.27,61.34 | 11.73,61.34 X5.3 X5.4 4.11,53.72 4.11,34.67 X4.1 7.92,32.77 13.51,38.35 C18.+ 21.13,37.85 IC6.7 v34.59,37.85 | 11.73,61.34 14.27,61.34 | 11.73,61.34 R15.2 | 16.18,61.34 31.42,61.34 32.05,61.98 | IC5.3 27.74,72.9 | 27.74,72.9 28.85,74.02 R19.2 28.85,85.95 51.87,108.97 IC1.9 | 32.05,61.98 32.05,68.58 27.74,72.9 | 32.05,61.98 41.35,61.98 53.29,50.04 53.29,44.55 58.72,39.12 SV1.9 | C19.2 IC6.20 v34.59,32.77
12V
  Bottom 0.762: 80.31,101.35 80.31,112.78 | 80.31,88.65 80.31,101.35 | 80.31,59.94 80.31,71.37 | IC1.3 80.31,101.35 | IC2.3 80.31,59.94 | IC3.3 81.58,18.24 80.31,19.51 80.31,29.67 | 80.31,59.94 80.31,47.24
  Bottom 1.27: IC1.3 D1.A C5.1 | IC2.3 D2.A C10.1 | IC3.3 D3.A C15.1 | 80.31,71.37 80.31,88.65 | 80.31,47.24 80.31,29.67 | 80.31,112.78 77.22,115.87 51.41,115.87 38.79,103.25 12.04,103.25 | X3.2 12.04,103.25 | X2.1 10.13,89.28 12.04,91.19 12.04,103.25
36V
  Bottom 1.27: 134.52,66.6 D21.C
  Bottom 1.778: 134.63,107.44 D11.C | D21.C 135.43,66.6 | D14.C 134.82,24.84
  Bottom 2.54: 109.22,110.21 109.22,111.1 111.35,113.23 | 109.22,110.21 109.22,72.39 | 111.35,113.23 Q5.D 128.84,113.23 | 109.22,72.39 109.52,72.09 Q2.D 128.42,72.09 128.47,72.14 | 109.22,110.21 F3.2 106.65,113.23 111.35,113.23 | 128.84,113.23 134.63,107.44 | C26.1 128.47,113.6 128.84,113.23 | C24.1 128.47,72.14 | 128.47,72.14 128.98,72.14 134.52,66.6 | C25.1 128.47,30.38 | 128.47,30.38 128.42,30.33 Q3.D 111.66,30.33 109.22,32.77 109.22,72.39 | 134.82,24.84 129.29,30.38 128.47,30.38
ADC0  (via drill 0.45 pad 1.4, 0.45 pad 3.05)
  Top 0.762: v26.97,32.16 v26.97,41
  Bottom 0.762: 34.54,41.66 29.06,41.66 | 38.3,40.49 38.4,40.39
  Bottom 1.27: v26.97,32.16 21.87,27.05 X4.2 X4.3 16.18,23.24 C29.1 v16.81,24.54 | v26.97,41 27.64,41.66 29.06,41.66 | IC6.23 38.4,40.39 | 38.3,40.49 37.13,41.66 34.54,41.66
GND  (via drill 0.45 pad 1.4, 0.45 pad 1.78, 0.45 pad 3.05)  (1 unrouted)
  Top 0.762: v48.56,46.74 v56.18,46.74 | v29.51,67.06 v34.59,67.06 | v28.24,64.52 v28.24,58.17
  Top 1.27: v75.23,81.03 v82.85,81.03 | v75.23,39.62 v82.85,39.62
  Bottom 0.762: 75.23,92.46 77.77,95 77.77,98.81 | IC1.11 76.5,103.89 77.77,102.62 77.77,98.81 | IC1.13 77.77,98.81 | 75.23,51.05 77.77,53.59 77.77,57.4 | 77.77,57.4 77.77,61.21 76.5,62.48 IC2.11 | IC2.13 77.77,57.4 | 77.77,15.7 77.77,11.89 76.71,10.82 76,10.82 76.35,10.46 | 77.77,15.7 77.77,19.51 76.5,20.78 IC3.11 | IC3.13 77.77,15.7 | 5.38,28.96 11.07,28.96 | C29.2 16.05,30.23 | 61.26,40.94 61.26,40.64 | 61.26,40.64 61.26,40.39 | 61.26,40.64 55.47,46.43 | 55.47,46.43 55.47,46.74 | 55.47,46.74 55.47,47.35 | C20.1 v48.56,46.74 | 55.47,46.74 v56.18,46.74 55.88,46.43 55.47,46.43 | LED1.K 26.01,78.94
  Bottom 1.27: C1.2 75.23,92.46 C2.- v75.23,81.03 | IC1.2 89.2,98.81 | 89.2,98.81 C5.2 | 89.2,98.81 93.14,98.81 R4.1 96.95,102.62 105.71,102.62 105.71,81.03 | C6.2 75.23,51.05 C7.- v75.23,39.62 | IC2.2 89.2,57.4 | 89.2,57.4 C10.2 | 105.71,81.03 105.71,61.21 | 105.71,61.21 105.71,39.62 | 105.71,39.62 105.71,19.51 | 105.71,19.51 105.71,6.81 | 89.2,57.4 93.01,57.4 R8.1 96.82,61.21 105.71,61.21 | C15.2 89.2,15.7 | 89.2,15.7 IC3.2 | 89.2,15.7 93.01,15.7 R12.1 96.82,19.51 105.71,19.51 | 7.92,74.68 X2.4 X5.1 X5.2 | v82.85,81.03 105.71,81.03 | v82.85,39.62 105.71,39.62 | C30.2 24.43,58.17 | C32.2 v28.24,58.17 24.43,58.17 | C31.2 24.43,58.17 | X5.2 13.03,65.15 C17.2 | X5.2 19.3,65.15 | 19.3,65.15 22.35,65.15 | 22.35,65.15 27.61,65.15 v28.24,64.52 28.24,66.4 28.91,67.06 v29.51,67.06 | C16.- 19.3,65.15 | 22.35,65.15 22,65.51 22.05,65.56 IC5.2 22.05,78.94 LED2.K LED1.K | 23.57,135.33 20.52,135.33 | 69.29,2.54 69.29,5.03 | v34.59,67.06 40.94,67.06 55.47,52.53 55.47,46.74 | v56.18,46.74 56.08,46.63 55.58,46.63 61.26,40.94 | 61.26,40.39 61.26,29.62 59.33,27.69 SV1.1 | X4.4 6.02,19.43 4.11,21.34 4.11,27.69 5.38,28.96 | 11.07,29.41 11.89,30.23 C29.2 20.62,34.04 C18.- 21.13,35.31 IC6.8 35.86,35.31 38.4,37.85 IC6.22 v44.75,37.85 46.02,39.12 | 46.02,39.12 C19.1 | C20.1 47.29,39.12 | v48.56,37.85 47.29,39.12 | 47.29,39.12 46.02,39.12 | C11.2 76,10.82 | 76.35,10.46 C12.-
  Bottom 1.778: 137.26,90.98 137.46,91.19 D20.A2 139.9,92.71 141.22,94.03 | 141.22,96.47 139.9,97.79 D20.A1 142.54,97.79 | D12.A1 139.4,56.95 | 141.22,54.1 141.53,54.41 141.53,54.81 139.4,56.95 | 139.4,56.95 141.43,56.95 141.83,56.54 | 137.57,49.73 137.46,49.83 D12.A2 137.67,51.66 139.4,51.66 | 140.61,51.66 139.4,51.66 | 139.4,51.66 140.31,52.58 141.22,52.58 | D13.A1 139.4,15.19 | 139.4,15.19 140.82,15.19 141.22,14.78 | 137.57,8.03 137.46,8.13 D13.A2 139.4,10.11 | 139.4,10.11 141.02,10.11 141.22,9.91 | 139.4,10.11 140.41,11.13 141.22,11.13 | 139.4,15.19 140.11,14.48 140.31,14.48 | 69.29,3.81 69.29,5.03 69.29,7.77 71.98,10.46 C11.2
  Bottom 2.54: K1.2 53.62,135.1 D10.A 52.45,135 | X4.4 18.34,19.43 35.23,2.54 69.29,2.54 101.45,2.54 105.71,6.81 106.88,7.98 Q4.S 128.42,7.98 C25.2 137.57,8.03 141.22,8.03 | 161.65,49.73 161.65,90.68 | Q6.S 128.42,90.58 | 128.42,90.58 C26.2 | 137.26,90.98 136.86,90.58 | 128.42,90.58 136.86,90.58 | 136.86,90.58 161.54,90.58 161.65,90.68 | Q1.S C24.2 137.57,49.73 142.14,49.73 | 161.65,49.73 142.14,49.73 | C23.1 142.09,116.33 145.19,113.23 145.19,100.43 142.54,97.79 141.22,96.47 141.22,94.03 141.22,91.29 | 142.14,49.73 141.22,50.65 141.22,52.58 141.22,54.1 141.22,56.24 145.19,60.2 145.19,72.09 141.78,75.49 C21.1 | 141.22,8.03 141.22,9.91 141.22,11.13 141.22,14.78 144.88,18.44 144.88,30.94 142.09,33.73 C22.1 | 161.65,90.68 161.65,128.47 159.21,130.91 132.69,130.91 123.85,139.75 64.77,139.75 K1.2 | 141.22,8.03 157.02,8.03 161.65,12.65 161.65,49.73 | 4.1 20.52,135.33 23.11,135.33 C28.2 | 23.57,135.33 34.39,135.33 C27.- 44.63,135.1 K1.2
HALL_1
  Bottom 1.27: X7.1 8.56,50.55 R13.1 C30.1 IC6.2
HALL_2
  Bottom 1.27: X7.2 13.64,47.37 R14.1 15.54,48.01 C31.1 IC6.3
HALL_3
  Bottom 1.27: X7.3 11.1,43.56 R15.1 18.08,44.2 19.35,45.47 C32.1 IC6.4
HO_1
  Bottom 1.27: R1.1 D4.C 84.12,114.05 82.85,112.78 IC1.7
HO_2
  Bottom 1.27: IC2.7 82.85,71.37 84.12,72.64 D6.C R5.1
HO_3
  Bottom 1.27: IC3.7 82.85,29.67 84.12,30.94 D8.C R9.1
LO_1
  Bottom 1.27: IC1.1 82.98,96.14 D5.C 82.98,88.77 R3.1
LO_2
  Bottom 1.27: R7.1 D7.C IC2.1
LO_3
  Bottom 1.27: IC3.1 D9.C R11.1
N$1
  Bottom 1.27: R2.2 D4.A R1.2 92.25,119.63
  Bottom 2.54: Q5.G 118.8,119.74 117.27,121.26 102.87,121.26 99.36,117.75 R2.2
N$2  (via drill 0.6 pad 3.05)
  Top 1.27: v101.9,98.81 v113.33,98.81
  Bottom 1.27: R3.2 90.47,92.2 D5.A 90.73,92.46 R4.2 100.76,98.81 v101.9,98.81
  Bottom 2.54: Q6.G 116.28,101.75 v113.33,98.81
N$3
  Bottom 2.54: K1.S 86.23,123.16 98.58,135.51 F3.1
N$4  (via drill 0.6 pad 3.05)
  Top 1.27: v101.9,77.72 v113.33,77.72
  Bottom 1.27: R5.2 D6.A R6.2 99.36,75.18 v101.9,77.72
  Bottom 2.54: Q2.G 113.39,77.67 v113.33,77.72
N$5  (via drill 0.6 pad 3.05)
  Top 1.27: v113.33,57.4 v101.9,57.4
  Bottom 1.27: R7.2 D7.A R8.2 100.63,57.4 v101.9,57.4 | Q1.G 118.69,60.81 116.74,60.81
  Bottom 2.54: v113.33,57.4 116.74,60.81 119.28,60.81
N$7  (via drill 0.6 pad 3.05)
  Top 1.27: v101.9,36.02 v113.33,36.02
  Bottom 1.27: R9.2 D8.A R10.2 99.36,33.48 v101.9,36.02
  Bottom 1.778: Q3.G 116.64,35.92 116.54,36.02
  Bottom 2.54: v113.33,36.02 116.54,36.02 118.31,36.02
N$8  (via drill 0.6 pad 3.05)
  Top 1.27: v101.9,15.7 v113.33,15.7
  Bottom 1.27: R11.2 D9.A R12.2 100.63,15.7 v101.9,15.7
  Bottom 2.54: v113.33,15.7 116.79,19.15 Q4.G
N$9
  Bottom 1.27: C17.1 13.26,72.09 | 13.26,72.09 13.26,81.66 9.45,85.47 X2.2 | 13.26,72.09 18.69,72.09 IC5.1 19.51,68.73 C16.+
N$10
  Bottom 0.762: R20.2 15.75,107.7
  Bottom 1.27: K1.1 58.98,124.31 D10.C 52.93,124.31 36.32,107.7 15.75,107.7 8.56,107.7 X3.1
N$11
  Bottom 2.54: 53.42,129.13 K1.P 49.53,129.13 40.34,119.94 C27.+ 38.25,118.57 23.27,118.57 | 5.1 23.27,118.87 23.27,118.57 | C28.1 23.27,112.37 23.27,118.57
N$14
  Bottom 1.27: 26.57,81.74 LED1.A 26.31,83.06 24.03,85.34 R19.1
N$18
  Bottom 1.27: C20.2 46.02,35.31 IC6.21
N$19
  Bottom 1.27: R20.1 15.75,85.04 LED2.A
N$20
  Bottom 1.27: SV1.4 IC6.19
N$21
  Bottom 1.27: SV1.2 IC6.18
N$22
  Bottom 1.27: SV1.6 52.37,32.77 51.1,34.04 51.1,48.16 43.64,55.63 34.59,55.63 IC6.1
N$29
  Bottom 2.54: R16.2 156.82,39.01 | 156.82,39.01 D18.C | C22.2 156.82,35.13 156.82,39.01
N$30
  Bottom 2.54: R17.2 156.87,80.67 D17.C 156.77,76.89 C21.2
N$31
  Bottom 1.778: R18.2 156.92,117.93
  Bottom 2.54: R18.2 156.92,121.51 D19.C 156.82,117.83 C23.2
S1
  Bottom 0.762: 46.69,20.07 49.23,22.61
  Bottom 1.27: SV2.5 49.23,22.61 | IC6.15 46.69,20.07
S1_
  Bottom 1.27: IC1.10 73.96,106.43 63.8,96.27 63.8,28.96 58.72,23.88 SV2.6
S2
  Bottom 0.762: IC6.11 33.32,27.69 35.86,25.15 35.86,16.26 36.25,15.88
  Bottom 1.27: SV3.5 38.4,13.72 36.25,15.88
S2_  (via drill 0.45 pad 1.78)
  Top 0.762: v68.28,67.56 68.43,67.41 v68.43,61.21
  Bottom 0.762: 68.38,67.56 v68.28,67.56 | 58.93,13.72 SV3.6
  Bottom 1.27: IC1.12 74.14,100.25 73.97,100.25 68.38,94.66 68.38,67.56 | v68.43,61.21 68.43,20.37 61.77,13.72 58.93,13.72
S3  (via drill 0.45 pad 1.78)
  Top 0.762: v46.02,22.61 48.56,20.07 v49.83,20.07
  Bottom 1.27: IC6.16 v46.02,22.61 | v49.83,20.07 SV2.3
S3_
  Bottom 1.27: SV2.4 60.86,20.07 66.24,25.45 66.24,62.99 68.28,65.02 IC2.10
S4
  Bottom 0.762: 34.59,13.72 34.59,23.88 33.32,25.15 IC6.12
  Bottom 1.27: 34.59,13.72 37.13,11.18 SV3.3
S4_
  Bottom 1.27: SV3.4 62.18,11.18 70.51,19.51 70.51,56.49 73.96,59.94 IC2.12
S5  (via drill 0.45 pad 1.78)
  Top 0.762: v53.64,35.31 v53.64,25.15
  Bottom 0.762: IC6.17 38.4,25.15 37.13,23.88 37.13,18.8 38.4,17.53 38.81,17.53
  Bottom 1.27: v53.64,35.31 53.64,36.58 54.91,37.85 SV1.10 | v53.64,25.15 IC6.17 | SV2.1 38.81,17.53
S5_  (via drill 0.45 pad 1.78)
  Top 0.762: v62.08,17.53 v62.08,8.64
  Bottom 1.27: v62.08,17.53 SV2.2 | v62.08,8.64 62.69,8.64 72.64,18.59 72.64,22.71 73.25,23.32 IC3.10
S6
  Bottom 0.762: 34.85,8.64 34.59,8.64 29.51,13.72
  Bottom 1.27: IC6.13 29.87,22.61 28.6,21.34 28.6,14.88 34.85,8.64 SV3.1
S6_
  Bottom 0.762: IC3.12 74.93,18.24 72.36,15.67
  Bottom 1.27: SV3.2 61.16,6.2 64.11,6.2 72.36,14.45 72.36,15.67
VB_1
  Bottom 1.27: IC1.6 D1.C C4.+ 95.55,108.97 C3.1
VB_2
  Bottom 1.27: IC2.6 D2.C C9.+ 95.55,67.56 C8.1
VB_3
  Bottom 1.27: IC3.6 D3.C C14.+ 95.55,25.86 C13.1
VS_1  (via drill 0.6 pad 3.05)
  Top 1.27: v101.9,107.7 v113.33,107.7
  Bottom 1.27: IC1.5 C4.- 95.55,106.43 | 95.55,106.43 C3.2 96.82,106.43 | 95.55,106.43 96.82,106.43 | 96.82,106.43 98.09,106.43 R2.1 v101.9,107.7
  Bottom 1.778: D20.C 134.52,95.25 | 141.22,106.22 139.9,104.9 D11.A2 136.65,104.09 135.74,104.09 | 139.75,121.41 D19.A | 137.72,112.78 137.46,112.52 D11.A1 140.51,109.98 141.22,109.27
  Bottom 2.54: v113.33,107.7 118.74,107.7 | 118.74,107.7 Q5.S | Q6.D 121.72,96.16 124.16,98.6 124.16,105 | R18.1 127.81,125.73 132.13,121.41 | U$1.1 150.37,102.67 150.37,117.7 D19.A 132.13,121.41 | 136.65,104.09 136.35,103.78 | 124.16,105 121.46,107.7 118.74,107.7 | 124.16,105 125.37,103.78 133.3,103.78 | 133.3,103.78 136.35,103.78 | 134.52,95.25 133.3,96.47 133.3,103.78 | 136.35,103.78 138.79,103.78 141.22,106.22 141.22,109.27 137.72,112.78 132.08,118.41 132.08,121.36 132.13,121.41
VS_2  (via drill 0.6 pad 3.05)
  Top 1.27: v101.9,66.29 v113.33,66.29
  Bottom 1.27: IC2.5 C9.- 95.55,65.02 | 95.55,65.02 C8.2 | 95.55,65.02 98.09,65.02 R6.1 v101.9,66.29
  Bottom 1.778: D21.A2 137.46,63.04 137.87,62.64 | D21.A2 138.89,64.06 139.4,63.55 | 137.57,72.39 137.46,72.29 D21.A1 140.82,69.14 141.22,68.73 | D21.A2 140.51,64.06 141.22,64.77 | 134.21,54.71 134.52,54.41 D12.C
  Bottom 2.54: 117.65,66.29 v113.33,66.29 120.7,66.29 120.9,66.5 | Q1.D 121.72,55.32 124.16,57.76 124.16,63.25 | 120.9,66.5 124.16,63.25 | 120.9,66.5 Q2.S | 124.16,63.25 124.76,62.64 133.3,62.64 | 133.3,62.64 137.87,62.64 139.09,62.64 141.22,64.77 141.22,68.73 137.57,72.39 133.6,76.35 133.6,79.96 134.21,80.57 | R17.1 114,85.19 128.42,85.19 133.05,80.57 134.21,80.57 | 134.21,80.57 D17.A 150.67,76.5 150.67,61.57 U$2.1 | 133.3,62.64 133.3,55.63 134.21,54.71
VS_3  (via drill 0.6 pad 3.05)
  Top 1.27: v101.9,24.59 v113.33,24.59
  Bottom 1.27: IC3.5 C14.- 95.55,23.32 | 95.55,23.32 C13.2 | 95.55,23.32 98.09,23.32 R10.1 v101.9,24.59
  Bottom 1.778: 140.92,27.58 140.72,27.38 D14.A1 137.26,27.58 137.26,30.02 138.18,30.02 138.18,28.19 | D13.C 134.52,12.65 133.3,13.87 | 141.22,23.01 140.51,22.3 D14.A2 137.46,20.78 137.26,20.57
  Bottom 2.54: v113.33,24.59 118.64,24.59 | 118.64,24.59 Q3.S | 124.16,20.57 124.16,16 121.72,13.56 Q4.D | 124.16,20.57 124.16,21.49 121.06,24.59 118.64,24.59 | 124.16,20.57 133.3,20.57 | R16.1 129.03,43.13 133.35,38.81 134.82,38.81 | 134.82,38.81 D18.A 150.67,34.59 150.67,19.86 U$3.1 | 134.82,38.81 133.6,37.59 133.6,34.49 140.72,27.38 141.22,26.87 141.22,23.01 138.79,20.57 137.26,20.57 133.3,20.57 | 133.91,13.26 133.3,13.87 133.3,20.57
(copper drawn outside any net)
  shapes: Bottom area x9, Bottom circle x1

### Text on the board
Top: PM | PM | 12V | 8V | GND | +HALL | +HALL | GND HALL | GND HALL | H1 | H2 | H3 | +P | sP | sP | -P
Bottom: -2020- | CAMPUS LUZERNA | CATARINENSE | IFC ECO TEAM | SEM